# Altium schematic sheet filter3210105209.SchDoc
size A4; SheetNumber: 3; SheetTotal: 3
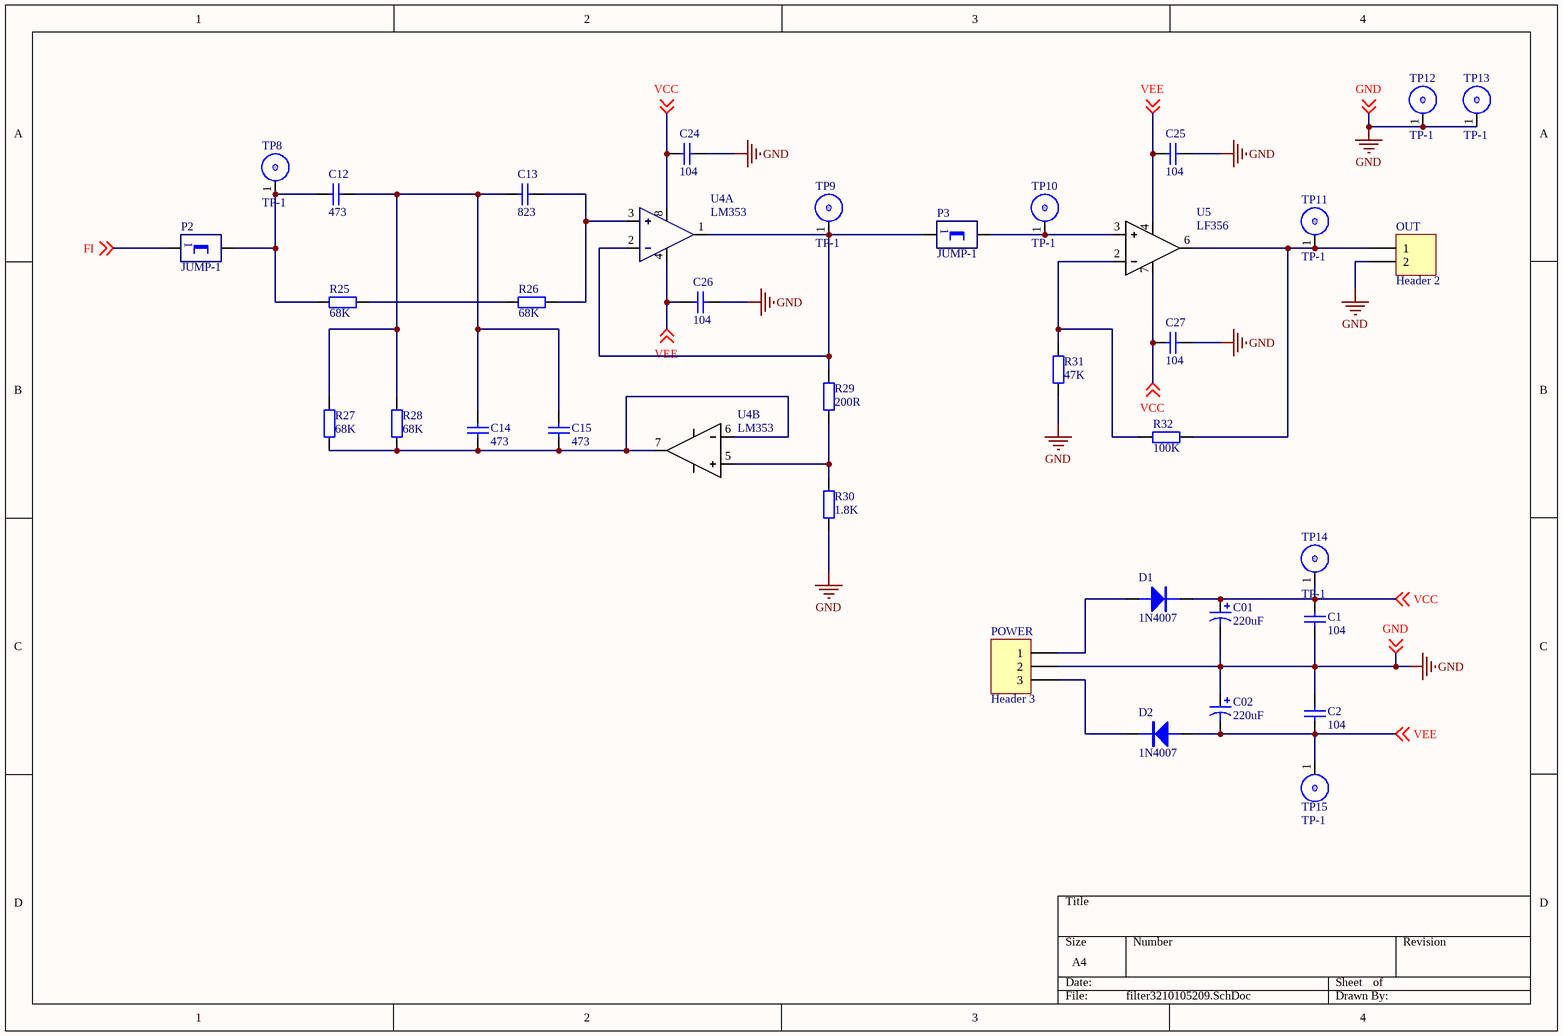
[diagram p0: filter3210105209.SchDoc]

## Parts
C01  220uF  [RB.15/.3]
C1  104  [C2]
C02  220uF  [RB.15/.3]
C2  104  [C2]
C12  473  [C2]
C13  823  [C2]
C14  473  [C2]
C15  473  [C2]
C24  104  [C2]
C25  104  [C2]
C26  104  [C2]
C27  104  [C2]
D1  1N4007  [DIODE0.4]
D2  1N4007  [DIODE0.4]
OUT  Header 2  [SIP2L]
P2  JUMP-1  [SIP2]
P3  JUMP-1  [SIP2]
POWER  Header 3  [POWER3]
R25  68K  [AXIAL-0.3]
R26  68K  [AXIAL-0.3]
R27  68K  [AXIAL-0.3]
R28  68K  [AXIAL-0.3]
R29  200R  [AXIAL-0.3]
R30  1.8K  [AXIAL-0.3]
R31  47K  [AXIAL-0.3]
R32  100K  [AXIAL-0.3]
TP8  TP-1  [tp-1-1]
TP9  TP-1  [tp-1-1]
TP10  TP-1  [tp-1-1]
TP11  TP-1  [tp-1-1]
TP12  TP-1  [tp-1-1]
TP13  TP-1  [tp-1-1]
TP14  TP-1  [tp-1-1]
TP15  TP-1  [tp-1-1]
U4  LM353  [DIP8]  (parts A,B of 2)
U5  LF356  [DIP8]

## Nets
GND: C1.1 C01.2 C02.1 C2.2 C24.2 C25.2 C26.2 C27.2 OUT.2 POWER.2 R30.1 R31.1 TP12.1 TP13.1 ; off-sheet GND
FI: P2.1 ; off-sheet FI
VCC: C01.1 C1.2 C24.1 C27.1 D1.K TP14.1 U4.8 U5.7 ; off-sheet VCC
VEE: C2.1 C02.2 C25.1 C26.1 D2.A TP15.1 U4.4 U5.4 ; off-sheet VEE
NetC12_1: C12.1 P2.2 R25.1 TP8.1
NetC12_2: C12.2 C13.1 C14.2 C15.2 R27.2 R28.2
NetC13_2: C13.2 R26.2 U4.3
NetC14_1: C14.1 C15.1 R27.1 R28.1 U4.6 U4.7
NetD1_A: D1.A POWER.1
NetD2_K: D2.K POWER.3
NetOUT_1: OUT.1 R32.2 TP11.1 U5.6
NetP3_1: P3.1 R29.2 TP9.1 U4.1 U4.2
NetP3_2: P3.2 TP10.1 U5.3
NetR25_2: R25.2 R26.1
NetR29_1: R29.1 R30.2 U4.5
NetR31_2: R31.2 R32.1 U5.2

## Library data of the parts
C01 C02 = Cap Pol1: Polarized Capacitor (Radial); Published: 8-Jun-2000; LatestRevisionDate: 17-Jul-2002; LatestRevisionNote: Re-released for DXP Platform.; PackageReference: RB7.6-15; Publisher: Altium Limited; PackageDescription: Polarized Capacitor (Radial); 2 Leads; Value: 220uF
C1 C2 C12-C15 C24-C27 = Cap: Capacitor; Value: 4700pF; Published: 8-Jun-2000; LatestRevisionDate: 17-Jul-2002; LatestRevisionNote: Re-released for DXP Platform.; PackageReference: RAD-0.3; Publisher: Altium Limited; PackageDescription: Radial Cap, Thru-Hole; 2 Leads; 0.3 in Pin Spacing
D1 D2 = DIODE
OUT = Header 2: Header, 2-Pin; LatestRevisionDate: 17-Jul-2002; LatestRevisionNote: Re-released for DXP Platform.; Publisher: Altium Limited
POWER = Header 3: Header, 3-Pin; LatestRevisionDate: 17-Jul-2002; LatestRevisionNote: Re-released for DXP Platform.; Publisher: Altium Limited
R25-R32 = Res2: Resistor; Value: 50K; Published: 8-Jun-2000; LatestRevisionDate: 17-Jul-2002; LatestRevisionNote: Re-released for DXP Platform.; PackageReference: AXIAL-0.4; Publisher: Altium Limited; PackageDescription: Axial Device, Thru-Hole; 2 Leads; 0.4 in Pin Spacing